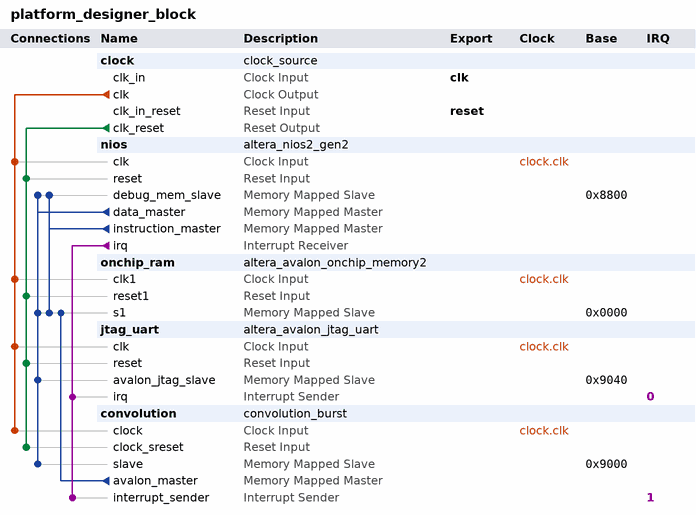
[diagram p0: system contents]
# Platform Designer (Qsys) system platform_designer_block, MAX 10 10M50DAF484C7G
# Parameters at their usual value, and those the tool derives, are not listed.
package require -exact qsys 18.1
create_system platform_designer_block
set_project_property DEVICE_FAMILY {MAX 10}
set_project_property DEVICE 10M50DAF484C7G

add_instance clock clock_source 18.1
set_instance_parameter_value clock clockFrequency 50000000

add_instance nios altera_nios2_gen2 18.1
set_instance_parameter_value nios dcache_size 2048
set_instance_parameter_value nios exceptionSlave onchip_ram.s1
set_instance_parameter_value nios icache_size 4096
set_instance_parameter_value nios impl Tiny
set_instance_parameter_value nios resetSlave onchip_ram.s1

add_instance onchip_ram altera_avalon_onchip_memory2 18.1
set_instance_parameter_value onchip_ram dataWidth 32
set_instance_parameter_value onchip_ram dualPort false
set_instance_parameter_value onchip_ram initMemContent true
set_instance_parameter_value onchip_ram initializationFileName onchip_mem.hex
set_instance_parameter_value onchip_ram memorySize 32768

add_instance jtag_uart altera_avalon_jtag_uart 18.1
set_instance_parameter_value jtag_uart simInteractiveOptions NO_INTERACTIVE_WINDOWS

add_instance convolution convolution_burst 1.0
set_instance_parameter_value convolution EXP 8
set_instance_parameter_value convolution FIFO_DEPTH 512
set_instance_parameter_value convolution KX 3
set_instance_parameter_value convolution KY 3
set_instance_parameter_value convolution MANT 7
set_instance_parameter_value convolution MAX_XRES 34
set_instance_parameter_value convolution RESOLUTIONS 3
set_instance_parameter_value convolution WIDTH 16
set_instance_parameter_value convolution WIDTHBC 9
set_instance_parameter_value convolution WIDTHBE 2
set_instance_parameter_value convolution WIDTHF 16
set_instance_parameter_value convolution XRES1 34
set_instance_parameter_value convolution XRES2 18
set_instance_parameter_value convolution XRES3 10
set_instance_parameter_value convolution XRES4 6
set_instance_parameter_value convolution XRES5 6
set_instance_parameter_value convolution YRES1 34
set_instance_parameter_value convolution YRES2 18
set_instance_parameter_value convolution YRES3 10
set_instance_parameter_value convolution YRES4 6
set_instance_parameter_value convolution YRES5 6

# connections
add_connection clock.clk convolution.clock clock
add_connection clock.clk jtag_uart.clk clock
add_connection clock.clk nios.clk clock
add_connection clock.clk onchip_ram.clk1 clock
add_connection clock.clk_reset convolution.clock_sreset reset
add_connection clock.clk_reset jtag_uart.reset reset
add_connection clock.clk_reset nios.reset reset
add_connection clock.clk_reset onchip_ram.reset1 reset
add_connection convolution.avalon_master onchip_ram.s1 avalon
set_connection_parameter_value convolution.avalon_master/onchip_ram.s1 baseAddress 0x0000
add_connection nios.data_master convolution.slave avalon
set_connection_parameter_value nios.data_master/convolution.slave baseAddress 0x9000
add_connection nios.data_master jtag_uart.avalon_jtag_slave avalon
set_connection_parameter_value nios.data_master/jtag_uart.avalon_jtag_slave baseAddress 0x9040
add_connection nios.data_master nios.debug_mem_slave avalon
set_connection_parameter_value nios.data_master/nios.debug_mem_slave baseAddress 0x8800
add_connection nios.data_master onchip_ram.s1 avalon
set_connection_parameter_value nios.data_master/onchip_ram.s1 baseAddress 0x0000
add_connection nios.instruction_master nios.debug_mem_slave avalon
set_connection_parameter_value nios.instruction_master/nios.debug_mem_slave baseAddress 0x8800
add_connection nios.instruction_master onchip_ram.s1 avalon
set_connection_parameter_value nios.instruction_master/onchip_ram.s1 baseAddress 0x0000
add_connection nios.irq convolution.interrupt_sender interrupt
set_connection_parameter_value nios.irq/convolution.interrupt_sender irqNumber 1
add_connection nios.irq jtag_uart.irq interrupt
set_connection_parameter_value nios.irq/jtag_uart.irq irqNumber 0

# exported interfaces
add_interface clk clock sink
set_interface_property clk EXPORT_OF clock.clk_in
add_interface reset reset sink
set_interface_property reset EXPORT_OF clock.clk_in_reset

set_interconnect_requirement {$system} qsys_mm.clockCrossingAdapter HANDSHAKE
set_interconnect_requirement {$system} qsys_mm.enableEccProtection FALSE
set_interconnect_requirement {$system} qsys_mm.insertDefaultSlave FALSE
set_interconnect_requirement {$system} qsys_mm.maxAdditionalLatency 1

save_system platform_designer_block.qsys
